# Altium schematic sheet Adapter.SchDoc
size A3; Address1: Address1; Address2: Address2; Address3: Address3; Address4: Address4
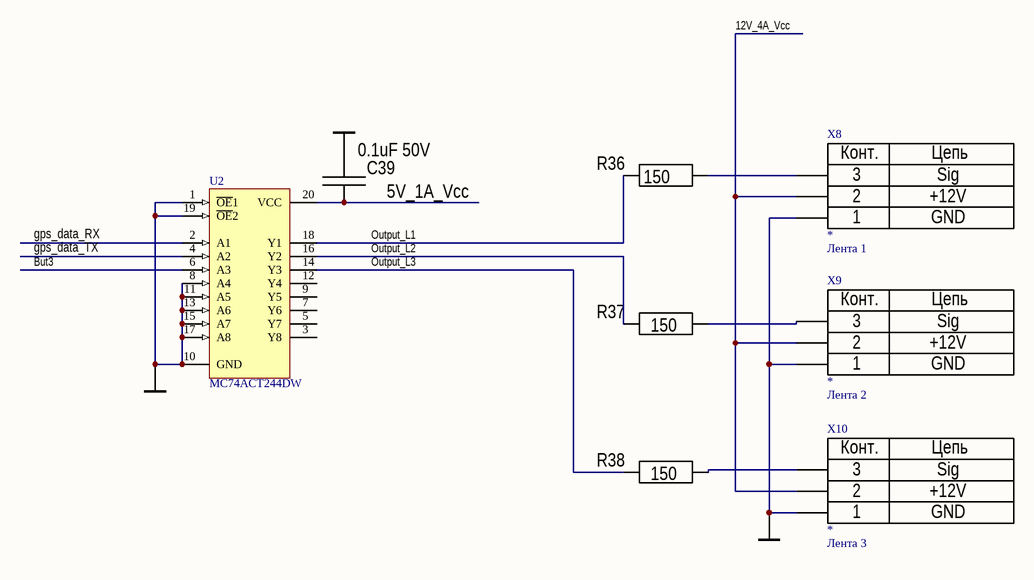
[diagram p0: Adapter.SchDoc]

## Parts
C39  0.1uF 50V  [0805_CAP]
R36  150  [0805_RES]
R37  150  [0805_RES]
R38  150  [0805_RES]
U2  MC74ACT244DW  [751D-04_N]
X8  *  Destiny: Лента 1  [3pad_5.08]
X9  *  Destiny: Лента 2  [3pad_5.08]
X10  *  Destiny: Лента 3  [3pad_5.08]

## Nets
GND: C39.2 U2.1(~{OE}1) U2.8(A4) U2.10(GND) U2.11(A5) U2.13(A6) U2.15(A7) U2.17(A8) U2.19(~{OE}2) X8.1 X9.1 X10.1
12V_4A_Vcc: X8.2 X9.2 X10.2
But3: U2.6(A3)
gps_data_RX: U2.2(A1)
gps_data_TX: U2.4(A2)
Output_L1: R36.1 U2.18(Y1)
Output_L2: R37.1 U2.16(Y2)
Output_L3: R38.1 U2.14(Y3)
NetC39_1: C39.1 U2.20(VCC)
NetR36_2: R36.2 X8.3
NetR37_2: R37.2 X9.3
NetR38_2: R38.2 X10.3

Not connected (* = marked no-connect by the designer): U2 3(Y8) 5(Y7) 7(Y6) 9(Y5) 12(Y4)

## Notes on the sheet
- Labels drawn without touching a wire or pin: 5V_1A_Vcc
- Title
- Size:
- Date:
- A3
- Number:
- Time:
- Revision:
- Sheet
- of
- File:
- (in symbol 3pin_conn) Конт.; Цепь

## Library data of the parts
C39 = Cap_np: Value: 0.1uF 50V
R36-R38 = Res: Value: 150
U2 = MC74ACT244DW: Octal Buffer/Line Driver with 3-State Outputs; Published: 15-Apr-2002; LatestRevisionDate: 13-Apr-2006; LatestRevisionNote: IPC-7351 Footprint Added.; DatasheetVersion: 9-Apr-1996; PackageReference: 751D-04; Publisher: Altium Limited; PackageDescription: 20-Pin Small Outline Integrated Circuit 1.27 mm Pitch; ComponentLink1Description: Manufacturer Link; ComponentLink1URL: http://www.onsemi.com/; ComponentLink2Description: Datasheet; ComponentLink2URL: http://www.onsemi.com/pub/Collateral/MC74AC244-D.PDF
X8-X10 = 3pin_conn: PinName1: GND; PinName2: +12V; PinName3: Sig; Value: *